# Altium schematic sheet SwitchBreakout.SchDoc
size A4
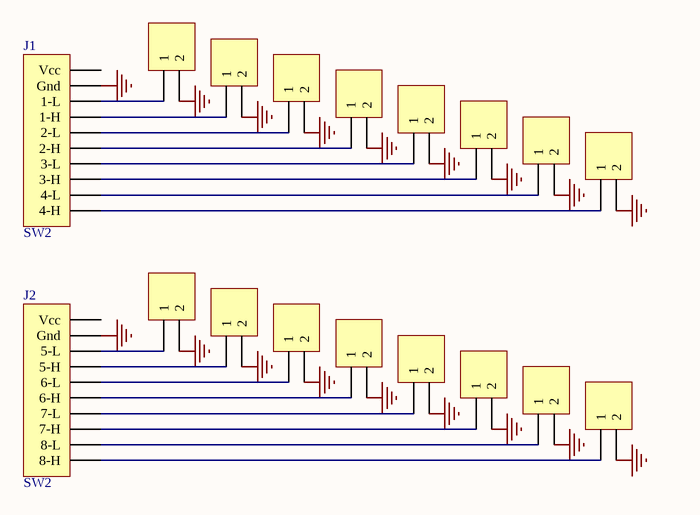
[diagram p0: SwitchBreakout.SchDoc]

## Parts
1-H  1-H  [HDR1X2]  (value not drawn)
2-L  2-L  [HDR1X2]  (value not drawn)
J1  SW2  [0.1 SIP 10 PIN]
J2  SW2  [0.1 SIP 10 PIN]
P1  1-L  [HDR1X2]  (value not drawn)
P4  2-H  [HDR1X2]  (value not drawn)
P5  3-L  [HDR1X2]  (value not drawn)
P6  3-H  [HDR1X2]  (value not drawn)
P7  4-L  [HDR1X2]  (value not drawn)
P8  4-H  [HDR1X2]  (value not drawn)
P9  5-L  [HDR1X2]  (value not drawn)
P10  5-H  [HDR1X2]  (value not drawn)
P11  6-L  [HDR1X2]  (value not drawn)
P12  6-H  [HDR1X2]  (value not drawn)
P13  7-L  [HDR1X2]  (value not drawn)
P14  7-H  [HDR1X2]  (value not drawn)
P15  8-L  [HDR1X2]  (value not drawn)
P16  8-H  [HDR1X2]  (value not drawn)

## Nets
GND: 1-H.2 2-L.2 J1.2(Gnd) J2.2(Gnd) P1.2 P4.2 P5.2 P6.2 P7.2 P8.2 P9.2 P10.2 P11.2 P12.2 P13.2 P14.2 P15.2 P16.2
Net1-H_1: 1-H.1 J1.4(1-H)
Net2-L_1: 2-L.1 J1.5(2-L)
NetJ1_3: J1.3(1-L) P1.1
NetJ1_6: J1.6(2-H) P4.1
NetJ1_7: J1.7(3-L) P5.1
NetJ1_8: J1.8(3-H) P6.1
NetJ1_9: J1.9(4-L) P7.1
NetJ1_10: J1.10(4-H) P8.1
NetJ2_3: J2.3(5-L) P9.1
NetJ2_4: J2.4(5-H) P10.1
NetJ2_5: J2.5(6-L) P11.1
NetJ2_6: J2.6(6-H) P12.1
NetJ2_7: J2.7(7-L) P13.1
NetJ2_8: J2.8(7-H) P14.1
NetJ2_9: J2.9(8-L) P15.1
NetJ2_10: J2.10(8-H) P16.1

Not connected (* = marked no-connect by the designer): J1 1(Vcc); J2 1(Vcc)

## Library data of the parts
1-H 2-L P1 P4-P16 = Header 2: Header, 2-Pin; LatestRevisionDate: 17-Jul-2002; LatestRevisionNote: Re-released for DXP Platform.; Publisher: Altium Limited
J1 J2 = Header 10: Header, 10-Pin; LatestRevisionDate: 17-Jul-2002; LatestRevisionNote: Re-released for DXP Platform.; Publisher: Altium Limited